# Altium schematic sheet top.SchDoc: TOP
size A4; Date: 10.02.2025; CheckedBy: BCY; DrawnBy: miaow; DocumentNumber: 1; Revision: v0.0.1; SheetNumber: 1; SheetTotal: 12; Sample: A0; Url: github.com/miaow-cn/pcb-lib; Liscense: GPLv3; Board: MIAOW FOC BOARD; BoardType: MAIN_PCB; Desc: top overview
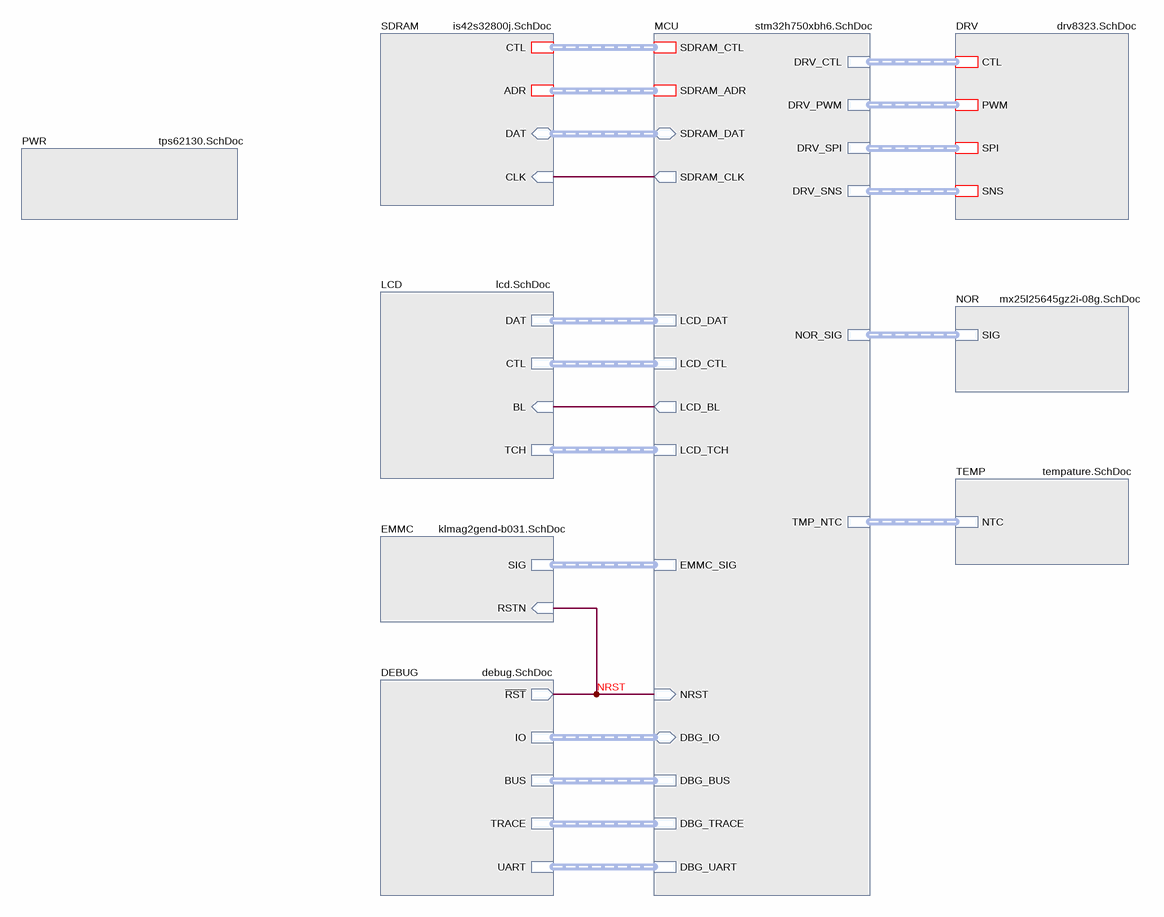
[diagram p0: top.SchDoc]

## Sub-sheets
DEBUG = debug.SchDoc: BUS (harness DBG_BUS), ~{RST} (out), TRACE (harness DBG_TRACE), UART (harness DBG_UART), IO (harness DBG_IO)
DRV = drv8323.SchDoc: CTL (harness DRV_CTL), SNS (harness DRV_SNS), SPI (harness DRV_SPI), PWM (harness DRV_PWM)
EMMC = klmag2gend-b031.SchDoc: SIG (harness EMMC_SIG), RSTN (in)
LCD = lcd.SchDoc: DAT (harness LCD_DAT), CTL (harness LCD_CTL), BL (in), TCH (harness LCD_TCH)
MCU = stm32h750xbh6.SchDoc: SDRAM_CLK (out), SDRAM_CTL (harness SDRAM_CTL), SDRAM_ADR (harness SDRAM_ADR), SDRAM_DAT (bidir, harness SDRAM_DAT), DRV_CTL (harness DRV_CTL), DRV_PWM (harness DRV_PWM), DRV_SPI (harness DRV_SPI), DRV_SNS (harness DRV_SNS), NRST (in), LCD_DAT (harness LCD_DAT), LCD_BL (out), LCD_TCH (harness LCD_TCH), EMMC_SIG (harness EMMC_SIG), NOR_SIG (harness NOR_SIG), LCD_CTL (harness LCD_CTL), DBG_TRACE (harness DBG_TRACE), DBG_UART (harness DBG_UART), DBG_BUS (harness DBG_BUS), DBG_IO (bidir, harness DBG_IO), TMP_NTC (harness TMP_NTC)
NOR = mx25l25645gz2i-08g.SchDoc: SIG (harness NOR_SIG)
PWR = tps62130.SchDoc: no entries
SDRAM = is42s32800j.SchDoc: ADR (harness SDRAM_ADR), CTL (harness SDRAM_CTL), CLK (in), DAT (bidir, harness SDRAM_DAT)
TEMP = tempature.SchDoc: NTC (harness TMP_NTC)

## Nets
NRST: sheet MCU/NRST, sheet EMMC/RSTN, sheet DEBUG/~{RST}
(unnamed): sheet SDRAM/CLK, sheet MCU/SDRAM_CLK
(unnamed): sheet MCU/LCD_BL, sheet LCD/BL

## Buses and harness runs
harness sheet DEBUG/BUS = sheet MCU/DBG_BUS
harness sheet DEBUG/IO = sheet MCU/DBG_IO
harness sheet DEBUG/TRACE = sheet MCU/DBG_TRACE
harness sheet DEBUG/UART = sheet MCU/DBG_UART
harness sheet DRV/CTL = sheet MCU/DRV_CTL
harness sheet DRV/PWM = sheet MCU/DRV_PWM
harness sheet DRV/SNS = sheet MCU/DRV_SNS
harness sheet DRV/SPI = sheet MCU/DRV_SPI
harness sheet EMMC/SIG = sheet MCU/EMMC_SIG
harness sheet LCD/CTL = sheet MCU/LCD_CTL
harness sheet LCD/DAT = sheet MCU/LCD_DAT
harness sheet LCD/TCH = sheet MCU/LCD_TCH
harness sheet MCU/NOR_SIG = sheet NOR/SIG
harness sheet MCU/SDRAM_ADR = sheet SDRAM/ADR
harness sheet MCU/SDRAM_CTL = sheet SDRAM/CTL
harness sheet MCU/SDRAM_DAT = sheet SDRAM/DAT
harness sheet MCU/TMP_NTC = sheet TEMP/NTC

## Notes on the sheet
- DRAWN
- CHECKED
- DRAWNBY
- SHEETS
- SHEETS_NO